# EAGLE schematic connection-schema (EAGLE 7.3.0)
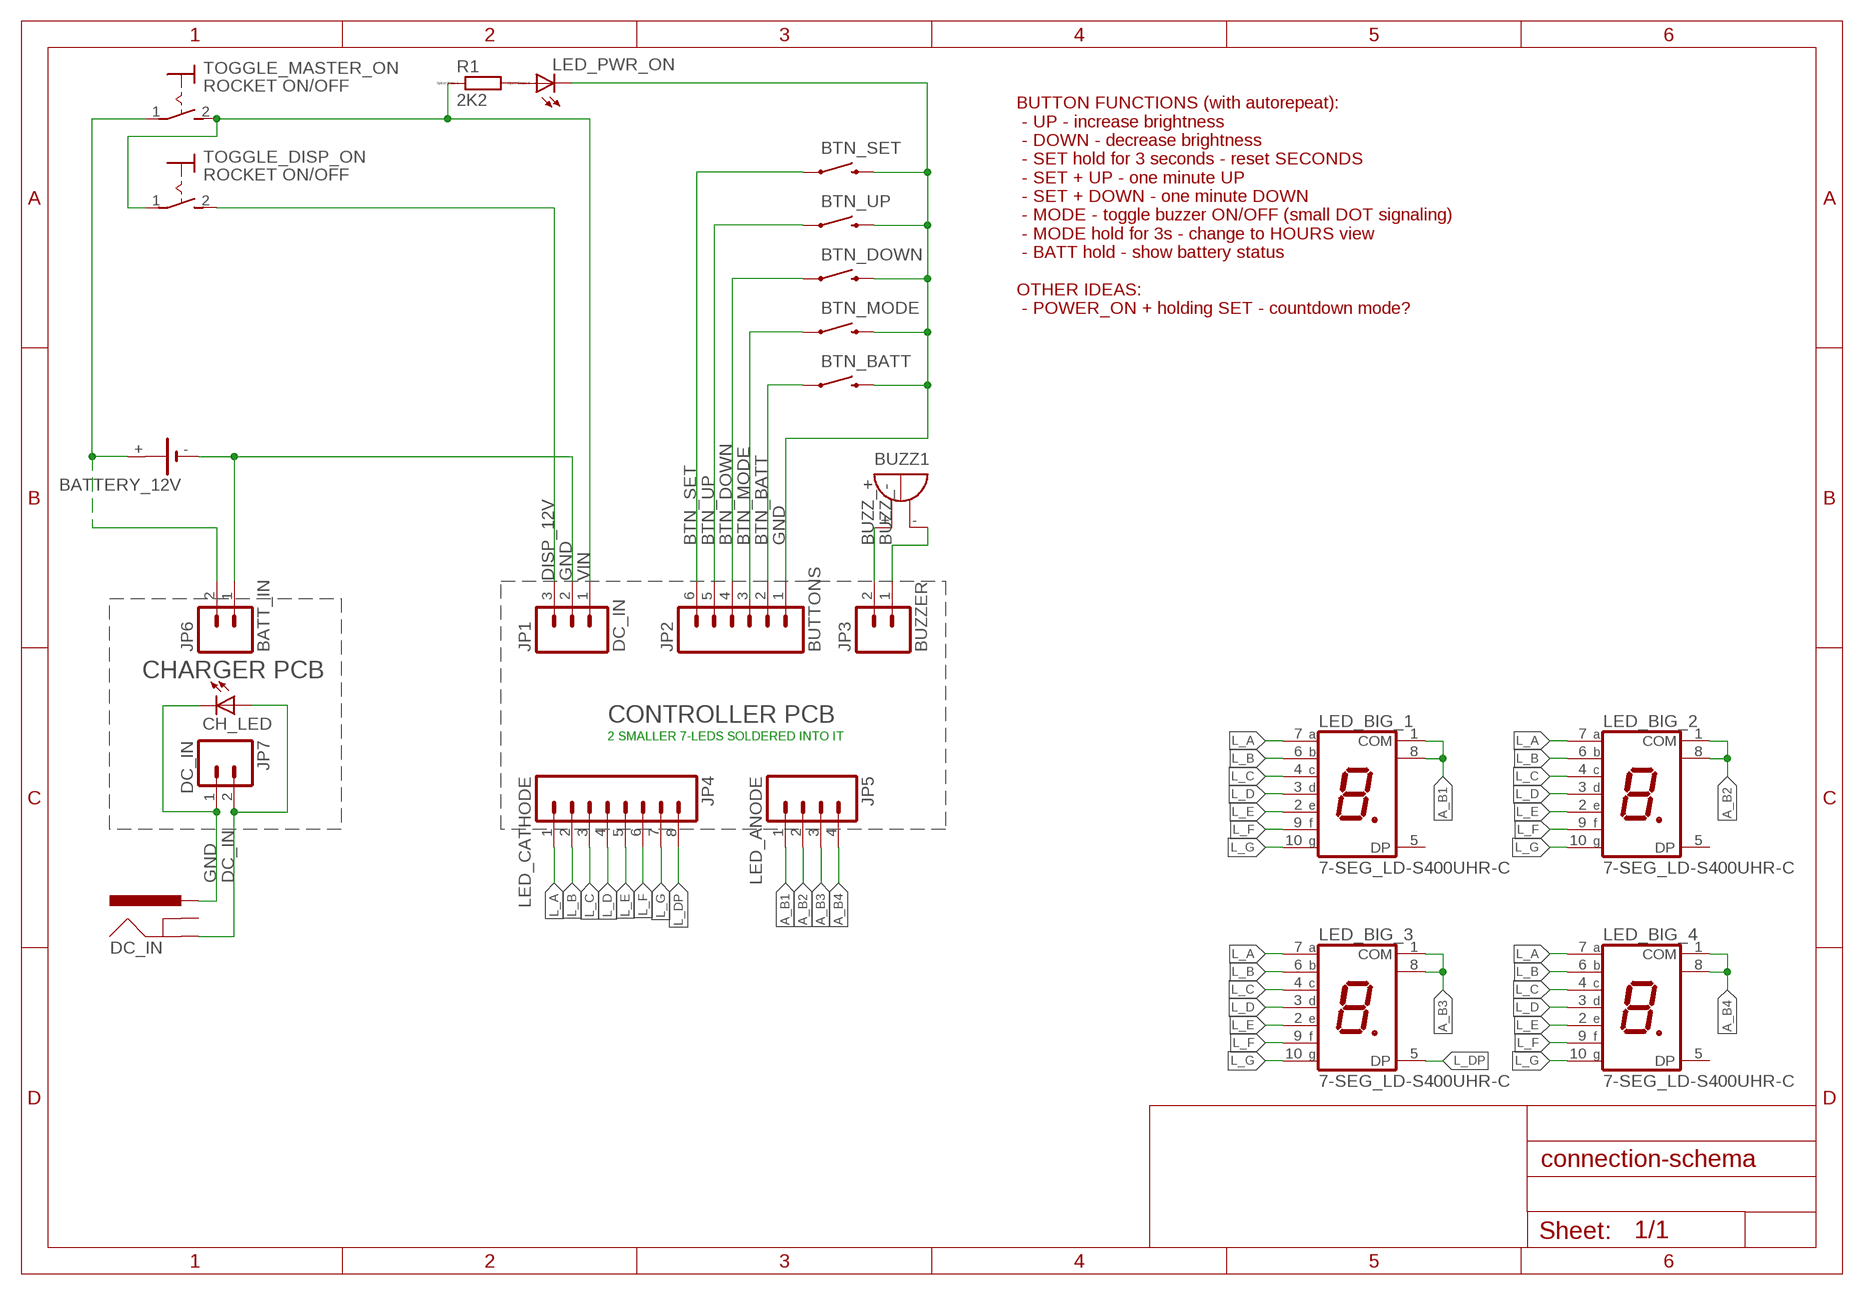
[diagram p0: schematic, sheet 1]

## Parts
BATTERY_12V  12V 7Ah  1V60R  [1V60R]
BTN_BATT  SWITCH-MOMENTARY-2PTH  [TACTILE-PTH]
BTN_DOWN  SWITCH-MOMENTARY-2PTH  [TACTILE-PTH]
BTN_MODE  SWITCH-MOMENTARY-2PTH  [TACTILE-PTH]
BTN_SET  SWITCH-MOMENTARY-2PTH  [TACTILE-PTH]
BTN_UP  SWITCH-MOMENTARY-2PTH  [TACTILE-PTH]
BUZZ1  F/BC40  [F/BC40]
CH_LED  LED5MM  [LED5MM]
DC_IN  POWER_JACKPTH  [POWER_JACK_PTH]
JP1  DC_IN  M03JST-PTH  [JST-3-PTH]
JP2  BUTTONS  M06LONGPADS  [1X06_LONGPADS]
JP3  BUZZER  M02POLAR  [MOLEX-1X2]
JP4  LED_CATHODE  M08  [1X08_ROUND]
JP5  LED_ANODE  M04PTH  [1X04]
JP6  BATT_IN  M02POLAR  [MOLEX-1X2]
JP7  DC_IN  M02POLAR  [MOLEX-1X2]
LED_BIG_1  7-SEG_LD-S400UHR-C  [LD-S400UHR-C]
LED_BIG_2  7-SEG_LD-S400UHR-C  [LD-S400UHR-C]
LED_BIG_3  7-SEG_LD-S400UHR-C  [LD-S400UHR-C]
LED_BIG_4  7-SEG_LD-S400UHR-C  [LD-S400UHR-C]
LED_PWR_ON  LED5MM  [LED5MM]
R1  2K2  R-EU_0207_10  [0207/10]
TOGGLE_DISP_ON  ROCKET ON/OFF  MS243  [MS243]
TOGGLE_MASTER_ON  ROCKET ON/OFF  MS243  [MS243]

## Nets
A_B1: JP5.1 LED_BIG_1.1(COM) LED_BIG_1.8(COM)
A_B2: JP5.2 LED_BIG_2.1(COM) LED_BIG_2.8(COM)
A_B3: JP5.3 LED_BIG_3.1(COM) LED_BIG_3.8(COM)
A_B4: JP5.4 LED_BIG_4.1(COM) LED_BIG_4.8(COM)
BTN_BATT: BTN_BATT.1 JP2.2
BTN_DOWN: BTN_DOWN.1 JP2.4
BTN_MODE: BTN_MODE.1
BTN_SET: BTN_SET.1 JP2.6
BTN_UP: BTN_UP.1 JP2.5
BUZZ_+: BUZZ1.+ JP3.2
BUZZ_-: BUZZ1.- JP3.1
DC_IN: CH_LED.A DC_IN.GND JP7.2
DISP_12V: JP1.3 TOGGLE_DISP_ON.2(S)
GND: BATTERY_12V.- BTN_BATT.3 BTN_DOWN.3 BTN_MODE.3 BTN_SET.3 BTN_UP.3 CH_LED.K(C) DC_IN.PWR JP1.2 JP2.1 JP6.1 JP7.1 LED_PWR_ON.K(C)
L_A: JP4.1 LED_BIG_1.7(A) LED_BIG_2.7(A) LED_BIG_3.7(A) LED_BIG_4.7(A)
L_B: JP4.2 LED_BIG_1.6(B) LED_BIG_2.6(B) LED_BIG_3.6(B) LED_BIG_4.6(B)
L_C: JP4.3 LED_BIG_1.4(C) LED_BIG_2.4(C) LED_BIG_3.4(C) LED_BIG_4.4(C)
L_D: JP4.4 LED_BIG_1.3(D) LED_BIG_2.3(D) LED_BIG_3.3(D) LED_BIG_4.3(D)
L_DP: JP4.8 LED_BIG_3.5(DP)
L_E: JP4.5 LED_BIG_1.2(E) LED_BIG_2.2(E) LED_BIG_3.2(E) LED_BIG_4.2(E)
L_F: JP4.6 LED_BIG_1.9(F) LED_BIG_2.9(F) LED_BIG_3.9(F) LED_BIG_4.9(F)
L_G: JP4.7 LED_BIG_1.10(G) LED_BIG_2.10(G) LED_BIG_3.10(G) LED_BIG_4.10(G)
N$1: BATTERY_12V.+ JP6.2 TOGGLE_MASTER_ON.1(P)
N$2: LED_PWR_ON.A R1.2
VIN: JP1.1 R1.1 TOGGLE_DISP_ON.1(P) TOGGLE_MASTER_ON.2(S)
Unconnected: BATTERY_12V.+@1(+) DC_IN.GNDBREAK JP2.3 LED_BIG_1.5(DP) LED_BIG_2.5(DP) LED_BIG_4.5(DP)

## Notes on the sheet
- BUTTON FUNCTIONS (with autorepeat):
   - UP - increase brightness
   - DOWN - decrease brightness
   - SET hold for 3 seconds - reset SECONDS
   - SET + UP - one minute UP
   - SET + DOWN - one minute DOWN
   - MODE - toggle buzzer ON/OFF (small DOT signaling)
   - MODE hold for 3s - change to HOURS view
   - BATT hold - show battery status
  
  OTHER IDEAS:
   - POWER_ON + holding SET - countdown mode?
- CHARGER PCB
- CONTROLLER PCB
- 2 SMALLER 7-LEDS SOLDERED INTO IT

## Library data of the parts
BATTERY_12V = battery:1V60R: NC ACCU Varta
BTN_BATT BTN_DOWN BTN_MODE BTN_SET BTN_UP = SparkFun-Electromechanical:SWITCH-MOMENTARY-2: Various NO switches- pushbuttons, reed, etc
BUZZ1 = buzzer:F/BC40: BUZZER Source: Spoerle; OC_FARNELL: unknown; OC_NEWARK: unknown
CH_LED LED_PWR_ON = led:LED: LED OSRAM: - CHIPLED LG R971, LG N971, LY N971, LG Q971, LY Q971, LO R971, LY R971 LH N974, LH R974 LS Q976, LO Q976, LY Q976 LO Q996 - Hyper CHIPLED LW Q18S LB Q993, LB Q99A, LB R99A - SideLED LS A670, LO A670, LY A670, LG A670, LP A670 LB A673, LV A673, LT A673, LW A673 LH A674 LY A675 LS A676, LA A676, LO A676, LY A676, LW A676 LS A679, LY A679, LG A679 - Hyper Micro SIDELED® LS Y876, LA Y876, LO Y876, LY Y876 LT Y87S - SmartLED LW L88C, LW L88S LB L89C, LB L89S, LG L890 LS L89K, LO L89K, LY L89K LS L896, LA L896, LO L896, LY L896 - TOPLED LS T670, LO T670, LY T670, LG T670, LP T670 LSG T670, LSP T670, LSY T670, LOP T670, LYG T670 LG T671, LOG T671, LSG T671 LB T673, LV T673, LT T673, LW T673 LH T674 LS T676, LA T676, LO T676, LY T676, LB T676, LH T676, LSB T676, LW T676 LB T67C, LV T67C, LT T67C, LS T67K, LO T67K, LY T67K, LW E67C LS E67B, LA E67B, LO E67B, LY E67B, LB E67C, LV E67C, LT E67C LW T67C LS T679, LY T679, LG T679 LS T770, LO T770, LY T770, LG T770, LP T770 LB T773, LV T773, LT T773, LW T773 LH T774 LS E675, LA E675, LY E675, LS T675 LS T776, LA T776, LO T776, LY T776, LB T776 LHGB T686 LT T68C, LB T68C - Hyper Mini TOPLED® LB M676 - Mini TOPLED Santana® LG M470 LS M47K, LO M47K, LY M47K Source: http://www.osram.convergy.de LUXEON: - LUMILED® LXK2-PW12-R00, LXK2-PW12-S00, LXK2-PW14-U00, LXK2-PW14-V00 LXK2-PM12-R00, LXK2-PM12-S00, LXK2-PM14-U00 LXK2-PE12-Q00, LXK2-PE12-R00, LXK2-PE12-S00, LXK2-PE14-T00, LXK2-PE14-U00 LXK2-PB12-K00, LXK2-PB12-L00, LXK2-PB12-M00, LXK2-PB14-N00, LXK2-PB14-P00, LXK2-PB14-Q00 LXK2-PR12-L00, LXK2-PR12-M00, LXK2-PR14-Q00, LXK2-PR14-R00 LXK2-PD12-Q00, LXK2-PD12-R00, LXK2-PD12-S00 LXK2-PH12-R00, LXK2-PH12-S00 LXK2-PL12-P00, LXK2-PL12-Q00, LXK2-PL12-R00 Source: www.luxeon.com KINGBRIGHT: KA-3528ASYC Source: www.kingbright.com
DC_IN = SparkFun-Connectors:POWER_JACK: Power Jack This is the standard 5.5mm barrel jack for power. The PTH is the most common, proven, reliable, footprint. The Slot footprint only works if the mill layer is transmitted to the PCB fab house so be warned. Mating wall wart : TOL-00298 (and others); PROD_ID: CONN-08197
JP1 = SparkFun-Connectors:M03: Header 3 Standard 3-pin 0.1" header. Use with straight break away headers (SKU : PRT-00116), right angle break away headers (PRT-00553), swiss pins (PRT-00743), machine pins (PRT-00117), and female headers (PRT-00115). Molex polarized connector foot print use with SKU : PRT-08232 with associated crimp pins and housings.; SKU: PRT-09915
JP2 = SparkFun-Connectors:M06: Header 6 Standard 6-pin 0.1" header. Use with straight break away headers (SKU : PRT-00116), right angle break away headers (PRT-00553), swiss pins (PRT-00743), machine pins (PRT-00117), and female headers (PRT-00115). Molex polarized connector foot print use with SKU : PRT-08094 with associated crimp pins and housings. NOTES ON THE VARIANTS LOCK and LOCK_LONGPADS... This footprint was designed to help hold the alignment of a through-hole component (i.e. 6-pin header) while soldering it into place. You may notice that each hole has been shifted either up or down by 0.005 of an inch from it's more standard position (which is a perfectly straight line). This slight alteration caused the pins (the squares in the middle) to touch the edges of the holes. Because they are alternating, it causes a "brace" to hold the component in place. 0.005 has proven to be the perfect amount of "off-center" position when using our standard breakaway headers. Although looks a little odd when you look at the bare footprint, once you have a header in there, the alteration is very hard to notice. Also,if you push a header all the way into place, it is covered up entirely on the bottom side. This idea of altering the position of holes to aid alignment will be further integrated into the Sparkfun Library for other footprints. It can help hold any component with 3 or more connection pins.
JP3 JP6 JP7 = SparkFun-Connectors:M02: Standard 2-pin 0.1" header. Use with - straight break away headers ( PRT-00116) - right angle break away headers (PRT-00553) - swiss pins (PRT-00743) - machine pins (PRT-00117) - female headers (PRT-00115) Molex polarized connector foot print use with: PRT-08233 with associated crimp pins and housings. 2.54_SCREWTERM for use with PRT-10571. 3.5mm Screw Terminal footprints for PRT-08084 5mm Screw Terminal footprints for use with PRT-08432
JP4 = SparkFun-Connectors:M08: Header 8 Standard 8-pin 0.1" header. Use with straight break away headers (SKU : PRT-00116), right angle break away headers (PRT-00553), swiss pins (PRT-00743), machine pins (PRT-00117), and female headers (PRT-00115).
JP5 = SparkFun-Connectors:M04: Header 4 Standard 4-pin 0.1" header. Use with straight break away headers (SKU : PRT-00116), right angle break away headers (PRT-00553), swiss pins (PRT-00743), machine pins (PRT-00117), and female headers (PRT-00115). Molex polarized connector foot print use with SKU : PRT-08231 with associated crimp pins and housings. 1MM SMD Version SKU: PRT-10208
LED_BIG_1-LED_BIG_4 = MINE:7-SEG_: Kingbright 14.2mm (0.56 INCH) SINGLE DIGIT NUMERIC DUISPLAY Source: SA56-11EWA(Ver1189471036.pdf
R1 = resistor:R-EU_: RESISTOR, European symbol; SPICEPREFIX: R
TOGGLE_DISP_ON TOGGLE_MASTER_ON = switch:MS243: TOGGLE SWITCH

## Net classes
0 default: width 0.152 mm, drill 0.305 mm, clearance 0.152 mm